# Altium schematic sheet USB.SchDoc
size A4; SheetNumber: 4; SheetTotal: 10
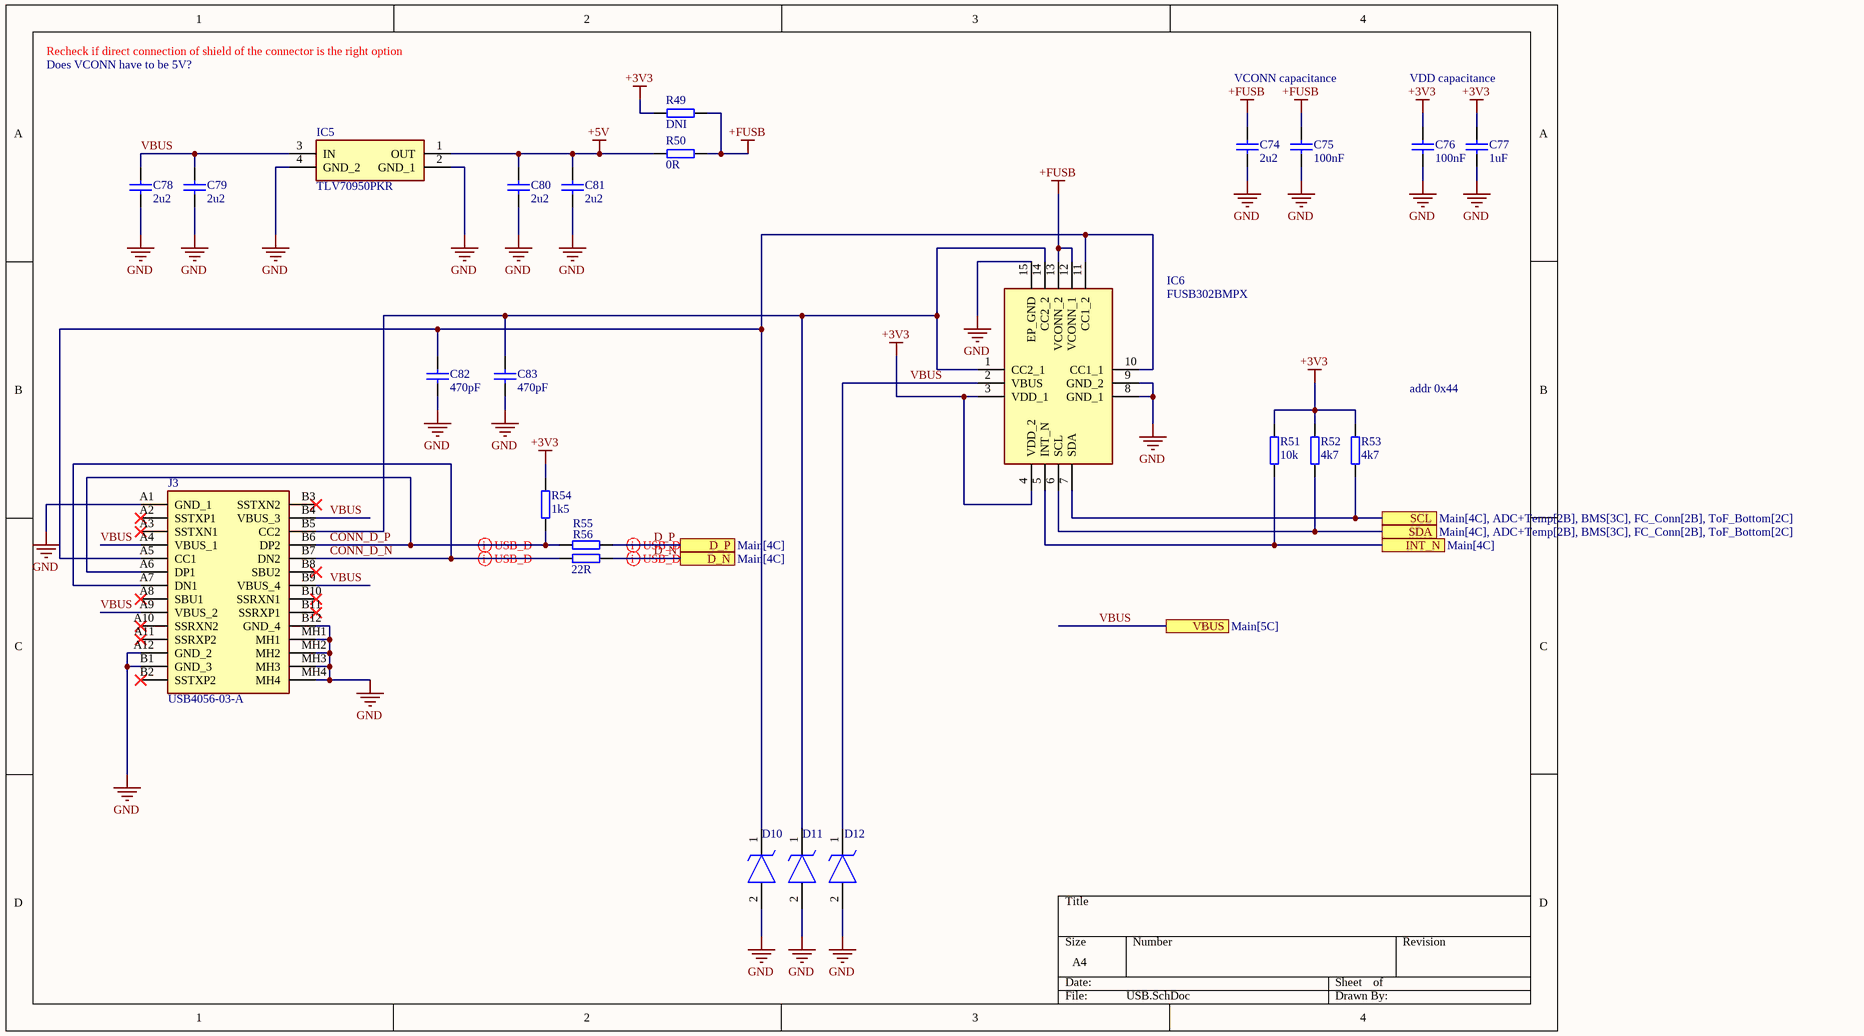
[diagram p0: USB.SchDoc]

## Parts
C74  value 2u2  [CAP0603]  (hidden comment: Cap0603)
C75  value 100nF  [CAP0402]  (hidden comment: Cap0402)
C76  value 100nF  [CAP0402]  (hidden comment: Cap0402)
C77  value 1uF  [CAP0402]  (hidden comment: Cap0402)
C78  value 2u2  [CAP0603]  (hidden comment: Cap0603)
C79  value 2u2  [CAP0603]  (hidden comment: Cap0603)
C80  value 2u2  [CAP0603]  (hidden comment: Cap0603)
C81  value 2u2  [CAP0603]  (hidden comment: Cap0603)
C82  value 470pF  [CAP0402]  (hidden comment: Cap0402)
C83  value 470pF  [CAP0402]  (hidden comment: Cap0402)
D10  D1213A-01LP4-7B  [D1213A01LP47B]  (value not drawn)
D11  D1213A-01LP4-7B  [D1213A01LP47B]  (value not drawn)
D12  DF2S24FS,L3M  [SODFL1006X45N]  (value not drawn)
IC5  TLV70950PKR  [TL431AQPKG3]
IC6  FUSB302BMPX  [QFN50P250X250X80-15N]
J3  USB4056-03-A  [USB405603A]
R49  value DNI  [RES0402]  (hidden comment: Res0402)
R50  value 0R  [RES0402]  (hidden comment: Res0402)
R51  value 10k  [RES0402]  (hidden comment: Res0402)
R52  value 4k7  [RES0402]  (hidden comment: Res0402)
R53  value 4k7  [RES0402]  (hidden comment: Res0402)
R54  value 1k5  [RES0402]  (hidden comment: Res0402)
R55  Res0402  [RES0402]  (value not drawn)
R56  value 22R  [RES0402]  (hidden comment: Res0402)

## Ports
D_N (see Main[4C]), D_P (see Main[4C]), INT_N (see Main[4C]), SCL (see Main[4C], ADC+Temp[2B], BMS[3C], FC_Conn[2B], ToF_Bottom[2C]), SDA (see Main[4C], ADC+Temp[2B], BMS[3C], FC_Conn[2B], ToF_Bottom[2C]), VBUS (see Main[5C])

## Nets
+3V3: C76.2 C77.2 IC6.3(VDD_1) IC6.4(VDD_2) R49.2 R51.2 R52.2 R53.2 R54.2
+5V: C80.2 C81.2 IC5.1(OUT) R50.2
+FUSB: C74.2 C75.2 IC6.12(VCONN_1) IC6.13(VCONN_2) R49.1 R50.1
GND: C74.1 C75.1 C76.1 C77.1 C78.1 C79.1 C80.1 C81.1 C82.1 C83.1 D10.2(A) D11.2(A) D12.2(A) IC5.2(GND_1) IC5.4(GND_2) IC6.8(GND_1) IC6.9(GND_2) IC6.15(EP_GND) J3.A1(GND_1) J3.A12(GND_2) J3.B1(GND_3) J3.B12(GND_4) J3.MH1 J3.MH2 J3.MH3 J3.MH4
CONN_D_N: J3.A7(DN1) J3.B7(DN2) R56.1
CONN_D_P: J3.A6(DP1) J3.B6(DP2) R54.1 R55.1
D_N: R56.2 ; port D_N
D_P: R55.2 ; port D_P
INT_N: IC6.5(INT_N) R51.1 ; port INT_N
SCL: IC6.7(SDA) R53.1 ; port SCL
SDA: IC6.6(SCL) R52.1 ; port SDA
VBUS: C78.2 C79.2 D12.1(K) IC5.3(IN) IC6.2(VBUS) J3.A4(VBUS_1) J3.A9(VBUS_2) J3.B4(VBUS_3) J3.B9(VBUS_4) ; port VBUS
NetC82_2: C82.2 D10.1(K) IC6.10(CC1_1) IC6.11(CC1_2) J3.A5(CC1)
NetC83_2: C83.2 D11.1(K) IC6.1(CC2_1) IC6.14(CC2_2) J3.B5(CC2)

Not connected (* = marked no-connect by the designer): J3 A2(SSTXP1)* A3(SSTXN1)* A8(SBU1)* A10(SSRXN2)* A11(SSRXP2)* B2(SSTXP2)* B3(SSTXN2)* B8(SBU2)* B10(SSRXN1)* B11(SSRXP1)*

## Layout directives
differential pair: CONN_D_N, CONN_D_P, D_N, D_P

## Notes on the sheet
- Recheck if direct connection of shield of the connector is the right option
- Does VCONN have to be 5V?
- VCONN capacitance
- VDD capacitance
- addr 0x44

## Library data of the parts
C74 C78-C81 = Cap0603: Manufacturer_Part_Number: GRT188R61H225KE13D; Voltage: 50V
C75 C76 = Cap0402: Manufacturer_Part_Number: GRM155R71H104ME14D; Voltage: 50V
C77 = Cap0402: Manufacturer_Part_Number: GRM155R61H105KE05J; Voltage: 50V
C82 C83 = Cap0402: Manufacturer_Part_Number: GCM155R71H471MA37D; Voltage: 50V
D10 D11 = D1213A-01LP4-7B: TVS Diode (Uni-directional); Manufacturer_Name: Diodes Incorporated; Datasheet Link: https://www.diodes.com/assets/Datasheets/D1213A-01LP4.pdf; Height: 0.4mm; Manufacturer_Part_Number: D1213A-01LP4-7B; Mouser Part Number: 621-D1213A-01LP4-7B; Mouser Price/Stock: https://www.mouser.co.uk/ProductDetail/Diodes-Incorporated/D1213A-01LP4-7B?qs=gfe7vQ8txpVKfG5NOSOvfA%3D%3D; Arrow Part Number: D1213A-01LP4-7B; Arrow Price/Stock: https://www.arrow.com/en/products/d1213a-01lp4-7b/diodes-incorporated?region=europe
D12 = DF2S24FS,L3M: TVS Diode (Uni-directional); Manufacturer_Name: Toshiba; Datasheet Link: https://www.mouser.com/datasheet/2/408/DF2S24FS_datasheet_en_20140718-708374.pdf; Height: 0.45mm; Manufacturer_Part_Number: DF2S24FS,L3M; Mouser Part Number: 757-DF2S24FSL3M; Mouser Price/Stock: https://www.mouser.co.uk/ProductDetail/Toshiba/DF2S24FSL3M?qs=lhkzy8lC%252BSvG2umxl0FuEw%3D%3D; Arrow Part Number: DF2S24FS,L3M; Arrow Price/Stock: https://www.arrow.com/en/products/df2s24fsl3m/toshiba?region=nac
IC5 = TLV70950PKR: Integrated Circuit; Manufacturer_Name: Texas Instruments; Datasheet Link: https://www.ti.com/lit/gpn/tlv709; Height: 1.6mm; Manufacturer_Part_Number: TLV70950PKR; Mouser Part Number: 595-TLV70950PKR; Mouser Price/Stock: https://www.mouser.co.uk/ProductDetail/Texas-Instruments/TLV70950PKR?qs=dbcCsuKDzFU3yYGsVf2izQ%3D%3D; Arrow Part Number: TLV70950PKR; Arrow Price/Stock: null?region=nac
IC6 = FUSB302BMPX: Integrated Circuit; Manufacturer_Name: onsemi; Datasheet Link: https://www.onsemi.com/pub/Collateral/FUSB302B-D.PDF; Height: 0.8mm; Manufacturer_Part_Number: FUSB302BMPX; Mouser Part Number: 512-FUSB302BMPX; Mouser Price/Stock: https://www.mouser.co.uk/ProductDetail/onsemi-Fairchild/FUSB302BMPX?qs=8ziscO3x5y1SHqdwooDK6g%3D%3D; Arrow Part Number: FUSB302BMPX; Arrow Price/Stock: https://www.arrow.com/en/products/fusb302bmpx/on-semiconductor?utm_currency=USD&region=nac
J3 = USB4056-03-A: Connector; Manufacturer_Name: GCT (GLOBAL CONNECTOR TECHNOLOGY); Datasheet Link: https://www.mouser.jp/datasheet/2/837/usb4056-2448808.pdf; Height: 3.56mm; Manufacturer_Part_Number: USB4056-03-A; Mouser Part Number: 640-USB4056-03-A; Mouser Price/Stock: https://www.mouser.co.uk/ProductDetail/GCT/USB4056-03-A?qs=QNEnbhJQKvbZ7hZzgFEugA%3D%3D
R50 = Res0402: Manufacturer_Part_Number: RCA04020000ZSED
R51 = Res0402: Manufacturer_Part_Number: ERA-2AED103X
R52 R53 = Res0402: Manufacturer_Part_Number: RC0402JR-7W4K7L
R54 = Res0402: Manufacturer_Part_Number: ERA-2AEB152X
R55 = Res0402: Manufacturer_Part_Number: MCS04020C2209FE000; Value: 22R
R56 = Res0402: Manufacturer_Part_Number: MCS04020C2209FE000